# EasyEDA Pro project My_first_PCB.epro, board PCB1
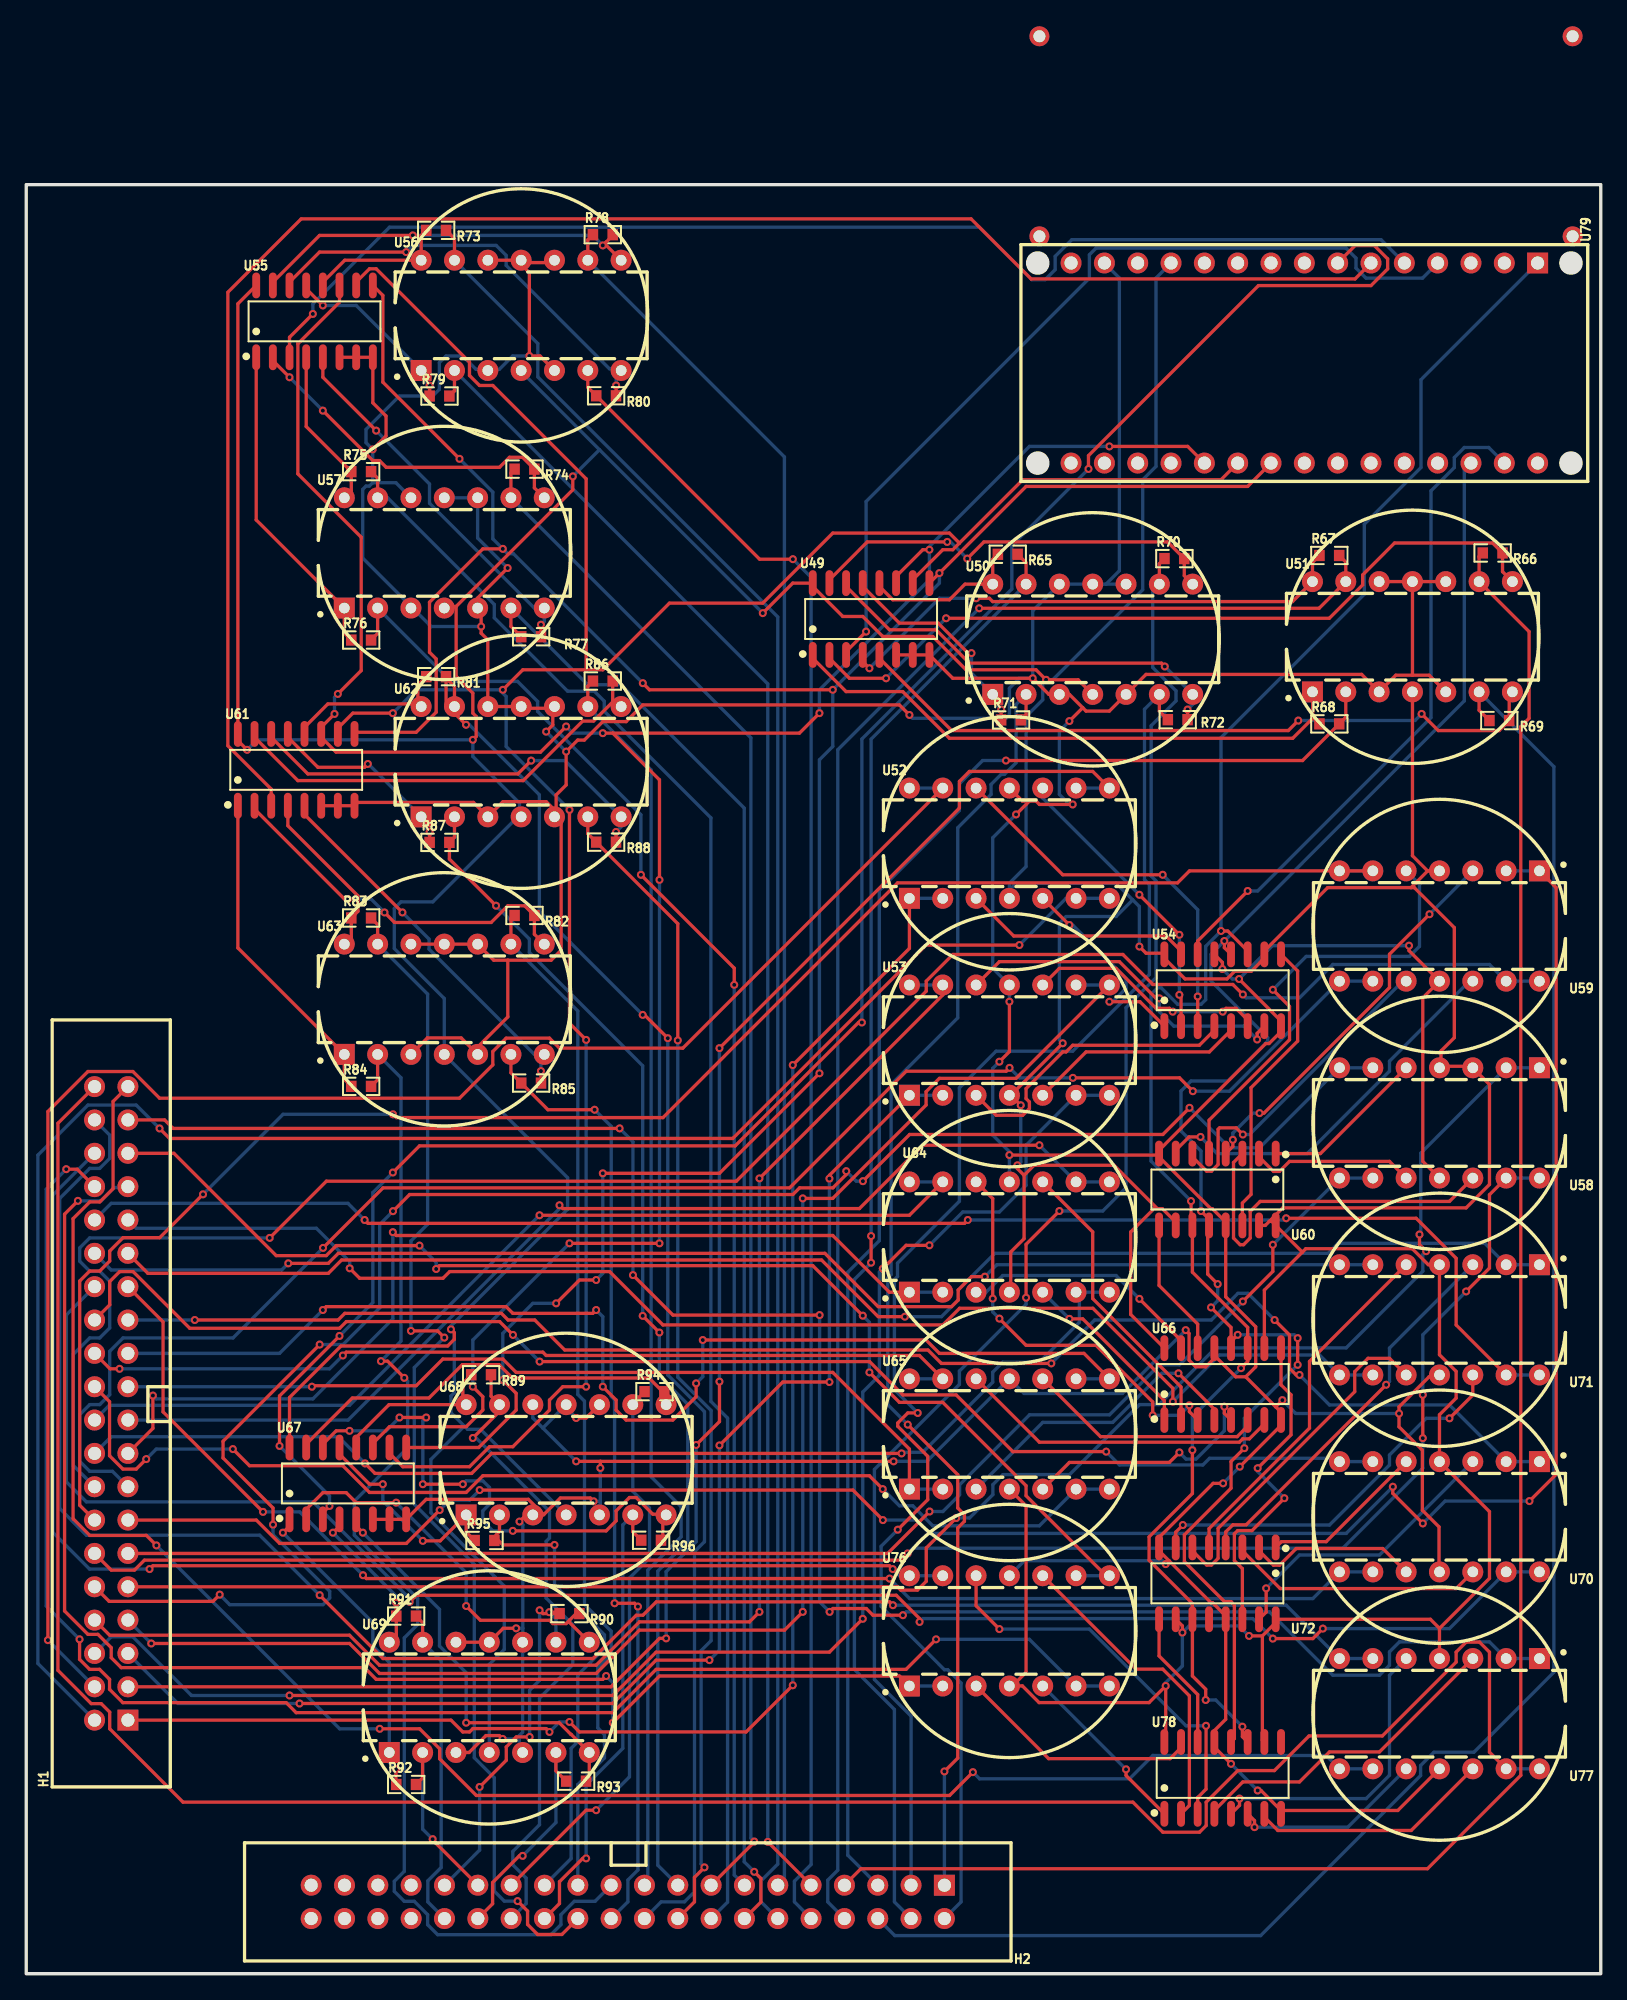
[diagram p4: board, top side]
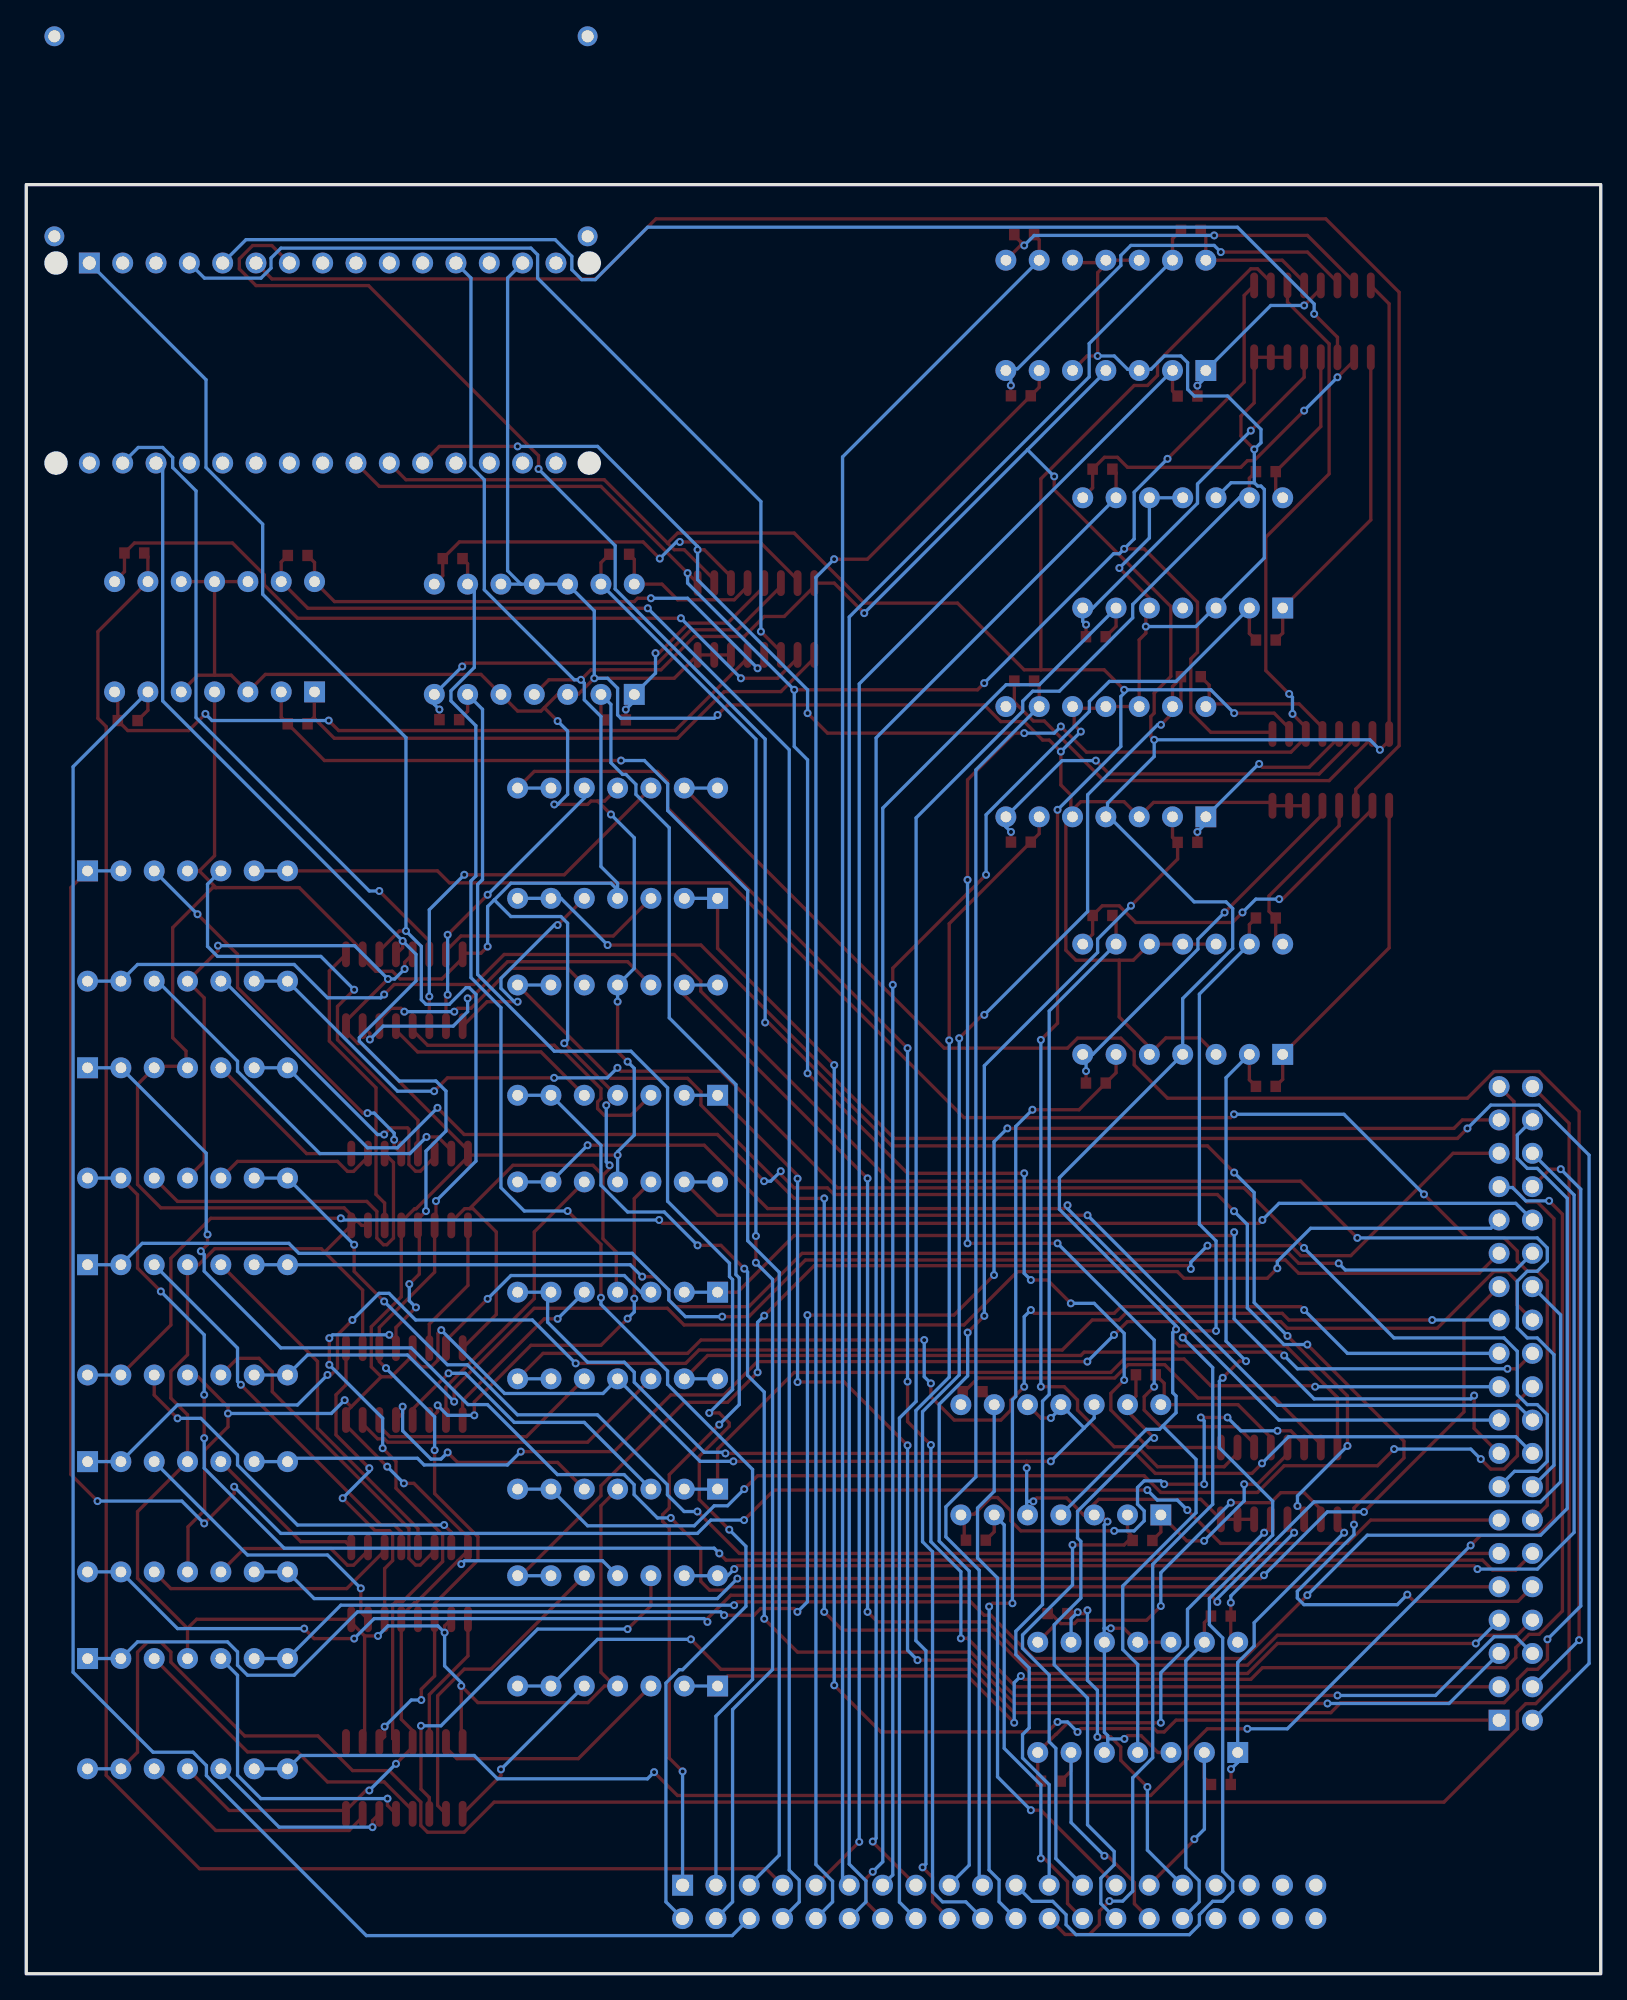
[diagram p5: board, bottom side, seen from below]

Outline 120 x 136.28 mm; copper layers: Top Layer, Bottom Layer. Coordinates in mm from the lower left corner of the outline.
Outline path: rectangle 0,136.28 120,0
Stack: Top Layer 0.035mm / Dielectric1 1.51mm FR4 er 4.5 / Bottom Layer 0.035mm

## Design rules (mm)
template: Custom Config
spacing copperThickness1oz (default): track to track 0.102, other pairs 0.152 to 0.3
spacing copperThickness2oz: track to track 0.203, other pairs 0.152 to 0.3
track width copperThickness1oz (default): min 0.127, default 0.254, max 2.54
track width copperThickness2oz: min 0.203, default 0.254, max 2.54
differential pair differentialPair (default): width min 0.127, default 0.254, max 2.54; gap min 0.152, default 0.152
via viaSize (default): diameter min 0.5, default 0.61, max 10; hole min 0.3, default 0.305, max 6.3

## Placement (name value [footprint] x y rotation side)
H1  HY2541WV-N-2x20P  [HDR-TH_40P-P2.54-V-F-R2-C20-S2.54_6]  6.48 43.45 90 top
H2  HY2541WV-N-2x20P  [HDR-TH_40P-P2.54-V-F-R2-C20-S2.54_6]  45.85 5.47 180 top
NOREF  -  [Pad_e246170]  77.22 147.59 0 top
NOREF#2  -  [Pad_e246173]  117.86 132.35 0 top
NOREF#3  -  [Pad_e246171]  77.22 132.35 0 top
NOREF#4  -  [Pad_e246172]  117.86 147.59 0 top
R65  1kΩ  [R0603]  74.8 108.13 180 top
R66  1kΩ  [R0603]  111.76 108.23 180 top
R67  1kΩ  [R0603]  99.31 108.04 0 top
R68  1kΩ  [R0603]  99.31 95.21 0 top
R69  1kΩ  [R0603]  112.27 95.46 180 top
R70  1kΩ  [R0603]  87.5 107.8 0 top
R71  1kΩ  [R0603]  75.06 95.51 0 top
R72  1kΩ  [R0603]  87.76 95.53 180 top
R73  1kΩ  [R0603]  31.24 132.8 180 top
R74  1kΩ  [R0603]  37.97 114.61 180 top
R75  1kΩ  [R0603]  25.53 114.42 0 top
R76  1kΩ  [R0603]  25.53 101.59 0 top
R77  1kΩ  [R0603]  38.48 101.85 180 top
R78  1kΩ  [R0603]  43.94 132.47 0 top
R79  1kΩ  [R0603]  31.5 120.18 0 top
R80  1kΩ  [R0603]  44.2 120.2 180 top
R81  1kΩ  [R0603]  31.24 98.8 180 top
R82  1kΩ  [R0603]  37.97 80.61 180 top
R83  1kΩ  [R0603]  25.53 80.42 0 top
R84  1kΩ  [R0603]  25.53 67.59 0 top
R85  1kΩ  [R0603]  38.48 67.85 180 top
R86  1kΩ  [R0603]  43.94 98.47 0 top
R87  1kΩ  [R0603]  31.5 86.18 0 top
R88  1kΩ  [R0603]  44.2 86.2 180 top
R89  1kΩ  [R0603]  34.67 45.63 180 top
R90  1kΩ  [R0603]  41.4 27.44 180 top
R91  1kΩ  [R0603]  28.96 27.24 0 top
R92  1kΩ  [R0603]  28.96 14.42 0 top
R93  1kΩ  [R0603]  41.91 14.67 180 top
R94  1kΩ  [R0603]  47.88 44.34 0 top
R95  1kΩ  [R0603]  34.92 33 0 top
R96  1kΩ  [R0603]  47.62 33.02 180 top
U49  CD4051BP  [SOIC-16_L9.9-W3.9-P1.27-LS6.0-BL]  64.39 103.2 0 top
U50  LM324N_C20616361  [DIP-14_L19.2-W6.6-P2.54-LS10.9-BL]  81.28 101.65 0 top
U51  LM324N_C20616361  [DIP-14_L19.2-W6.6-P2.54-LS10.9-BL]  105.65 101.85 0 top
U52  LM324N_C20616361  [DIP-14_L19.2-W6.6-P2.54-LS10.9-BL]  74.93 86.12 0 top
U53  LM324N_C20616361  [DIP-14_L19.2-W6.6-P2.54-LS10.9-BL]  74.93 71.12 0 top
U54  MC74HC595ADR2  [SOIC-16_L9.9-W3.9-P1.27-LS6.0-BL]  91.19 74.92 0 top
U55  CD4051BP  [SOIC-16_L9.9-W3.9-P1.27-LS6.0-BL]  21.97 125.87 0 top
U56  LM324N_C20616361  [DIP-14_L19.2-W6.6-P2.54-LS10.9-BL]  37.72 126.33 0 top
U57  LM324N_C20616361  [DIP-14_L19.2-W6.6-P2.54-LS10.9-BL]  31.86 108.23 0 top
U58  LM324N_C20616361  [DIP-14_L19.2-W6.6-P2.54-LS10.9-BL]  107.71 64.81 180 top
U59  LM324N_C20616361  [DIP-14_L19.2-W6.6-P2.54-LS10.9-BL]  107.71 79.81 180 top
U60  MC74HC595ADR2  [SOIC-16_L9.9-W3.9-P1.27-LS6.0-BL]  90.78 59.74 180 top
U61  CD4051BP  [SOIC-16_L9.9-W3.9-P1.27-LS6.0-BL]  20.57 91.71 0 top
U62  LM324N_C20616361  [DIP-14_L19.2-W6.6-P2.54-LS10.9-BL]  37.72 92.33 0 top
U63  LM324N_C20616361  [DIP-14_L19.2-W6.6-P2.54-LS10.9-BL]  31.86 74.23 0 top
U64  LM324N_C20616361  [DIP-14_L19.2-W6.6-P2.54-LS10.9-BL]  74.93 56.12 0 top
U65  LM324N_C20616361  [DIP-14_L19.2-W6.6-P2.54-LS10.9-BL]  74.93 41.12 0 top
U66  MC74HC595ADR2  [SOIC-16_L9.9-W3.9-P1.27-LS6.0-BL]  91.19 44.92 0 top
U67  CD4051BP  [SOIC-16_L9.9-W3.9-P1.27-LS6.0-BL]  24.51 37.35 0 top
U68  LM324N_C20616361  [DIP-14_L19.2-W6.6-P2.54-LS10.9-BL]  41.15 39.15 0 top
U69  LM324N_C20616361  [DIP-14_L19.2-W6.6-P2.54-LS10.9-BL]  35.29 21.05 0 top
U70  LM324N_C20616361  [DIP-14_L19.2-W6.6-P2.54-LS10.9-BL]  107.71 34.81 180 top
U71  LM324N_C20616361  [DIP-14_L19.2-W6.6-P2.54-LS10.9-BL]  107.71 49.81 180 top
U72  MC74HC595ADR2  [SOIC-16_L9.9-W3.9-P1.27-LS6.0-BL]  90.78 29.74 180 top
U76  LM324N_C20616361  [DIP-14_L19.2-W6.6-P2.54-LS10.9-BL]  74.93 26.12 0 top
U77  LM324N_C20616361  [DIP-14_L19.2-W6.6-P2.54-LS10.9-BL]  107.71 19.81 180 top
U78  MC74HC595ADR2  [SOIC-16_L9.9-W3.9-P1.27-LS6.0-BL]  91.19 14.92 0 top
U79  ABX00028  [MOD-TH_ABX00028]  97.41 122.69 270 top

## Footprints (pads in the part's own frame, mm; a bottom-side part is the same pattern mirrored in y, then rotated)
DIP-14_L19.2-W6.6-P2.54-LS10.9-BL
  rect 1.6x1.6 hole 0.813: 1(-7.62,-4.2)
  round 1.6 hole 0.813: 2(-5.08,-4.2) 3(-2.54,-4.2) 4(0,-4.2) 5(2.54,-4.2) 6(5.08,-4.2) 7(7.62,-4.2) 8(7.62,4.2) 9(5.08,4.2) 10(2.54,4.2) 11(0,4.2) 12(-2.54,4.2) 13(-5.08,4.2) 14(-7.62,4.2)
HDR-TH_40P-P2.54-V-F-R2-C20-S2.54_6
  rect 1.6x1.6 hole 1: 1(-24.13,-1.27)
  round 1.6 hole 1: 2(-24.13,1.27) 3(-21.59,-1.27) 4(-21.59,1.27) 5(-19.05,-1.27) 6(-19.05,1.27) 7(-16.51,-1.27) 8(-16.51,1.27) 9(-13.97,-1.27) 10(-13.97,1.27) 11(-11.43,-1.27) 12(-11.43,1.27) 13(-8.89,-1.27) 14(-8.89,1.27) 15(-6.35,-1.27) 16(-6.35,1.27) 17(-3.81,-1.27) 18(-3.81,1.27) 19(-1.27,-1.27) 20(-1.27,1.27) 21(1.27,-1.27) 22(1.27,1.27) 23(3.81,-1.27) 24(3.81,1.27) 25(6.35,-1.27) 26(6.35,1.27) 27(8.89,-1.27) 28(8.89,1.27) 29(11.43,-1.27) 30(11.43,1.27) 31(13.97,-1.27) 32(13.97,1.27) 33(16.51,-1.27) 34(16.51,1.27) 35(19.05,-1.27) 36(19.05,1.27) 37(21.59,-1.27) 38(21.59,1.27) 39(24.13,-1.27) 40(24.13,1.27)
MOD-TH_ABX00028
  rect 1.6x1.6 hole 1: 1(-7.62,17.78)
  round 1.6 hole 1: 2(-7.62,15.24) 3(-7.62,12.7) 4(-7.62,10.16) 5(-7.62,7.62) 6(-7.62,5.08) 7(-7.62,2.54) 8(-7.62,0) 9(-7.62,-2.54) 10(-7.62,-5.08) 11(-7.62,-7.62) 12(-7.62,-10.16) 13(-7.62,-12.7) 14(-7.62,-15.24) 15(-7.62,-17.78) 16(7.62,-17.78) 17(7.62,-15.24) 18(7.62,-12.7) 19(7.62,-10.16) 20(7.62,-7.62) 21(7.62,-5.08) 22(7.62,-2.54) 23(7.62,0) 24(7.62,2.54) 25(7.62,5.08) 26(7.62,7.62) 27(7.62,10.16) 28(7.62,12.7) 29(7.62,15.24) 30(7.62,17.78)
Pad_e246170
  round 1.524 hole 0.914: 1(0,0)
Pad_e246171
  round 1.524 hole 0.914: 2(0,0)
Pad_e246172
  round 1.524 hole 0.914: 3(0,0)
Pad_e246173
  round 1.524 hole 0.914: 4(0,0)
R0603
  rect 0.806x0.864 smd: 1(-0.753,0) 2(0.753,0)
SOIC-16_L9.9-W3.9-P1.27-LS6.0-BL
  oval 0.602x1.971 smd: 1(-4.445,-2.736) 2(-3.175,-2.736) 3(-1.905,-2.736) 4(-0.635,-2.736) 5(0.635,-2.736) 6(1.905,-2.736) 7(3.175,-2.736) 8(4.445,-2.736) 9(4.445,2.736) 10(3.175,2.736) 11(1.905,2.736) 12(0.635,2.736) 13(-0.635,2.736) 14(-1.905,2.736) 15(-3.175,2.736) 16(-4.445,2.736)

## Nets
As in the schematic.

Pads without a net: H2 33 34 35 36 37 38 39 40; NOREF 1; NOREF#2 4; NOREF#3 2; NOREF#4 3; U72 12; U78 9; U79 2 3 8 9 10 11 13 15 16 17 18 19 23 24 25 26 27 30

## Via types
v1: diameter 0.61, hole 0.305, Top Layer to Bottom Layer, 338 vias

## Routing (per net, layer and track width the routed paths; a pad name or vN(x,y) marks a point on that pad's centre or on a via; arc(x,y) is an arc through that point)
$1N14304: length 51
  Top Layer w0.254: v1(93.09,82.48) 89.28,78.67 U54.14
  Bottom Layer w0.254: v1(93.09,82.48) 93.85,82.48 107.06,95.69 107.06,112.96 108.84,114.74 108.84,115.5 109.6,116.26 111.46,116.26 U79.29
$1N14310: length 17.5
  Top Layer w0.254: U54.15 88.01,77.91 86.87,79.05 75.26,79.05 72.39,81.92
$1N14316: length 119.5
  Top Layer w0.254: v1(41.4,19.18) 42.16,18.42 54.86,18.42 v1(58.42,21.97) ; v1(39.88,18.42) 39.62,18.67 34.04,18.67 33.78,18.42 33.27,18.42 32.37,19.32 H1.1 ; v1(58.42,69.22) 67.31,78.11 U52.1
  Bottom Layer w0.254: U52.1 U52.2 ; v1(39.88,18.42) 40.64,19.18 v1(41.4,19.18) ; v1(58.42,69.22) v1(58.42,21.97)
$1N14330: length 136.1
  Top Layer w0.254: R67.2 100.57,107.53 100.57,106.05 98.54,104.01 v1(72.63,104.01)
  Bottom Layer w0.254: H2.8 61.09,5.47 61.09,7.13 61.85,7.89 61.85,93.23 v1(72.63,104.01)
$1N14338: length 40.1
  Top Layer w0.254: v1(64.26,99.44) 63.75,99.95 63.75,100.46 ; v1(72.39,104.78) 73.41,104.78 73.66,104.52 96.51,104.52 U51.14 98.03,107.5 R67.1
  Bottom Layer w0.254: v1(64.26,99.44) 69.6,104.78 v1(72.39,104.78)
$1N14350: length 111.4
  Top Layer w0.254: v1(64.39,56.2) v1(64.39,54.16) ; U50.13 76.2,107.49 R65.1
  Bottom Layer w0.254: v1(64.39,54.16) 63.12,52.89 63.12,23.18 66.17,20.13 66.17,5.47 H2.4 ; v1(64.39,56.2) 64.39,94.04 U50.13
$1N14355: length 109.9
  Top Layer w0.254: U53.13 69.85,74.56 v1(55.88,60.59) ; H1.8 6.36,25.79 24.64,25.79 26.92,23.5 43.43,23.5 46.74,26.8 55.12,26.8 v1(55.88,27.57)
  Bottom Layer w0.254: U53.13 U53.14 ; v1(55.88,60.59) v1(55.88,27.57)
$1N14369: length 119.8
  Top Layer w0.254: v1(9.53,25.16) 24.64,25.16 26.92,22.87 43.43,22.87 46.74,26.17 57.79,26.17 v1(59.18,27.57) ; v1(59.18,59.06) 61.47,59.06 68.58,66.17 68.58,67.19 69.6,68.21 75.44,68.21 U53.8
  Bottom Layer w0.254: v1(9.53,25.16) H1.7 ; U53.8 80.01,75.32 ; v1(59.18,59.06) v1(59.18,27.57)
$1N14384: length 101.2
  Top Layer w0.254: v1(61.21,45.07) 57.66,45.07 v1(52.83,40.25) ; v1(52.07,23.89) 48.01,23.89 44.7,20.59 v1(20.83,20.59) ; U53.1 61.21,60.82 v1(61.21,60.57)
  Bottom Layer w0.254: v1(52.83,40.25) 52.83,24.65 v1(52.07,23.89) ; v1(61.21,60.57) v1(61.21,45.07) ; H1.5 11.56,20.59 v1(20.83,20.59) ; U53.1 U53.2
$1N14390: length 115.2
  Top Layer w0.254: v1(20.07,21.2) 44.7,21.2 48.01,24.5 61.21,24.5 v1(63.75,27.04) ; v1(65.28,53.71) 67.06,55.49 v1(68.83,55.49)
  Bottom Layer w0.254: v1(20.07,21.2) 12.59,21.2 8.12,25.67 6.48,25.67 H1.6 ; v1(63.75,27.04) 63.75,44.31 65.02,45.58 65.02,53.46 v1(65.28,53.71) ; U53.7 80.01,66.92 76.2,63.11 76.2,60.06 74.17,58.03 71.37,58.03 v1(68.83,55.49)
$1N14396: length 54.2
  Top Layer w0.254: v1(106.35,95.97) 107.62,94.7 112.26,94.7 R69.1 113.02,97.4 U51.7 ; v1(96.95,95.46) 96.19,94.7 70.53,94.7 65.02,100.21 U49.5
  Bottom Layer w0.254: v1(96.95,95.46) 105.84,95.46 v1(106.35,95.97)
$1N14405: length 44.2
  Top Layer w0.254: 98.04,95.63 98.13,95.63 R68.1 ; 98.04,95.63 96.52,94.11 70.36,94.11 66.8,97.67 62.48,97.67 59.94,100.21 U49.1 ; 98.04,95.63 98.04,97.63 U51.1
$1N14418: length 59.7
  Top Layer w0.254: v1(70.1,103.25) 99.31,103.25 101.85,105.79 101.85,106.56 104.29,108.99 111.75,108.99 R66.1 112.51,106.8 U51.8 ; v1(65.53,98.68) 62.74,98.68 61.21,100.21 U49.2
  Bottom Layer w0.254: v1(65.53,98.68) v1(70.1,103.25)
$1N14427: length 653
  Top Layer w0.254: 105.65,98.92 U51.11 ; 105.65,98.92 106.92,98.92 U51.5 ; 105.65,98.92 104.38,98.92 U51.3 101.78,98.98 85.34,98.98 U50.5 82.55,96.18 80.77,96.18 80.52,96.44 ; U51.11 U51.12 ; U51.11 U51.10 ; U60.8 86.22,62.36 v1(74.93,62.36) ; U60.8 86.34,62.22 90.28,58.27 90.4,58.27 91.42,57.26 U60.13 91.42,51.57 93.7,49.28 93.7,46.23 92.94,45.47 ; U60.8 86.34,62.73 94.46,70.86 94.72,70.86 95.48,71.62 ; v1(88.37,49.03) 88.62,48.77 88.62,46.74 89.13,46.23 89.89,46.23 90.65,46.99 ; 34.16,70.27 U63.5 ; 34.16,70.27 33.15,71.29 30.58,71.29 U63.3 ; 34.16,70.27 34.16,70.35 36.7,72.89 36.7,77.21 ; 36.7,77.21 40,77.21 40.77,77.97 40.77,87.62 U62.5 40.39,88.25 40.39,88.52 ; 36.7,77.21 35.63,77.21 U63.10 U63.11 U63.12 ; 95.63,12.44 94.11,13.96 v1(93.85,13.96) ; 95.63,12.44 104.53,12.44 U77.11 ; 95.63,12.44 U78.8 ; 87.1,31.46 86.34,32.22 U72.8 86.39,32.53 86.39,33.29 90.46,37.36 v1(91.22,37.36) ; 87.1,31.46 90.28,28.27 90.4,28.27 91.42,27.26 U72.13 91.42,19.38 90.55,18.52 U78.13 90.55,17.26 v1(91.82,15.99) ; 87.1,31.46 v1(86.84,31.2) ; 76.45,89.33 v1(75.44,88.31) ; 76.45,89.33 76.96,89.33 77.22,89.07 v1(79.76,89.07) ; 76.45,89.33 75.92,89.33 U52.11 ; 43.75,39.03 v1(41.91,39.03) ; 43.75,39.03 v1(66.1,39.03) ; 43.75,39.03 v1(43.75,38.52) ; U61.6 U61.7 U61.8 25.27,89.23 34.08,89.23 U62.3 36.34,89.28 39.62,89.28 40.39,88.52 ; 92.94,45.47 95.23,43.19 ; 92.94,45.47 92.18,45.47 90.65,46.99 ; 95.23,43.19 v1(95.73,43.69) ; 95.23,43.19 95.63,42.78 U66.8 95.63,41.77 v1(92.49,38.63) ; 39.44,34.97 40.71,36.24 42.99,36.24 v1(43.25,35.98) ; 39.44,34.97 38.63,34.97 U68.3 38.1,34.95 v1(37.59,34.44) ; 39.44,34.97 38.26,36.14 30.48,36.14 28.96,34.62 U67.7 U67.6 ; 90.65,46.99 90.65,47.55 U66.13 ; U71.11 107.57,45.47 106.91,45.47 104.62,43.19 v1(104.62,42.68) 104.62,41.66 106.4,39.88 106.4,35.31 107.67,34.04 107.67,30.65 U70.11 ; v1(105.39,78.31) 105.39,77.93 U59.11 106.44,74.34 106.44,61.88 U58.11 ; U69.12 U69.11 36.35,26.31 v1(37.34,26.31) ; v1(67.31,95.89) 66.55,96.65 46.99,96.65 45.72,95.38 43.94,95.38 42.54,93.97 42.03,93.97 v1(41.15,93.09) 41.15,90.55 40.39,89.79 40.39,88.52 ; U54.8 95.63,71.77 95.48,71.62 ; v1(92.43,75.77) 95.48,72.72 95.48,71.62 ; U68.10 42.67,42.33 v1(41.91,42.33) ; 37.84,130.34 37.84,130.09 38.34,129.58 v1(38.34,123.23) 39.16,123.23 U56.5 ; 37.84,130.34 40.07,130.34 U56.10 ; 37.84,130.34 37.84,130.41 U56.11 U56.12 ; v1(91.16,76.53) 91.16,77.04 U54.13 ; v1(74.17,69.48) 74.93,70.24 v1(74.93,74.05) ; 80.52,96.44 v1(79.5,95.42) ; 80.52,96.44 79.5,97.45 U50.3 77.94,97.45 v1(76.71,98.68) 70.61,98.68 U49.8 U49.7 U49.6 ; v1(36.31,17.89) 36.05,18.14 35.04,18.14 33.75,16.85 U69.3 ; v1(36.69,107.08) 34.4,104.79 U57.5 34.67,103.76 v1(34.67,102.62) 34.67,102.12 35.18,101.61 U62.12 U62.11 37.85,96.4 40.13,96.4 ; v1(26.41,116.12) 27.42,117.13 27.42,118.66 26.42,119.66 U55.8 U55.7 U55.6 ; 40.13,96.4 40.13,95.13 v1(39.62,94.62) ; 40.13,96.4 U62.10
  Bottom Layer w0.254: v1(37.59,34.44) 37.85,34.19 37.85,26.31 ; 37.85,26.31 v1(37.34,26.31) ; 37.85,26.31 37.85,25.27 U69.10 37.83,18.4 37.58,18.14 37.58,17.89 ; U69.5 37.58,17.11 37.58,17.89 ; 37.58,17.89 v1(36.31,17.89) ; 35.04,122.21 36.06,122.21 37.07,123.23 v1(38.34,123.23) ; 35.04,122.21 34.28,122.21 33.26,123.23 31.99,123.23 31.48,122.72 31.48,120.69 30.98,120.18 28.44,120.18 25.9,117.64 25.9,116.63 v1(26.41,116.12) 26.41,113.58 ; 35.04,122.21 U56.3 ; 26.41,113.58 28.17,113.58 U57.12 ; 26.41,113.58 26.15,113.32 25.9,113.32 25.64,113.07 25.64,107.84 29.45,104.03 ; v1(105.39,78.31) 94.97,78.31 v1(92.43,75.77) 91.92,75.77 v1(91.16,76.53) ; 39.37,41.57 U68.11 41.15,43.1 v1(41.91,42.33) ; 39.37,41.57 v1(41.91,39.03) ; 39.37,41.57 38.61,42.33 U68.12 ; v1(74.17,69.48) 73.66,68.97 73.66,63.89 74.93,62.62 U64.11 ; v1(95.73,43.69) 96.75,42.68 v1(104.62,42.68) ; 82.3,105.85 U50.10 ; 82.3,105.85 U50.11 U50.12 76.71,103.82 v1(76.71,98.68) 75.69,98.68 74.93,97.92 74.93,95.89 74.68,95.63 67.56,95.63 v1(67.31,95.89) ; 82.3,105.85 83.31,106.87 83.31,129.17 U79.14 ; v1(86.84,31.2) 86.59,31.46 76.07,31.46 U76.11 ; 29.45,104.03 U57.3 ; 29.45,104.03 30.86,102.62 v1(34.67,102.62) ; v1(74.93,74.05) U53.11 73.66,76.59 73.66,86.53 v1(75.44,88.31) ; U57.11 U57.10 34.4,109.37 v1(36.69,107.08) ; v1(43.75,38.52) 43.75,35.98 ; 43.75,35.98 v1(43.25,35.98) ; 43.75,35.98 43.75,35.02 U68.5 ; v1(79.76,89.07) 79.5,89.07 78.74,89.83 78.74,94.66 v1(79.5,95.42) ; v1(88.37,49.03) 83.54,44.2 76.05,44.2 U65.11 68.65,39.03 v1(66.1,39.03) ; v1(92.49,38.63) v1(91.22,37.36) ; v1(41.15,93.09) v1(39.62,94.62) ; v1(91.82,15.99) v1(93.85,13.96)
$1N14475: length 140.4
  Top Layer w0.254: U51.6 110.73,96.25 R69.2
  Bottom Layer w0.254: H2.6 66.2,2.9 94.08,2.9 106.27,15.1 106.27,15.86 107.28,16.87 110.33,16.87 116.43,22.97 116.43,91.94 U51.6
$1N14479: length 611.1
  Top Layer w0.254: 107.71,26.31 U77.4 ; 107.71,26.31 107.01,27 U72.16 95.23,26.75 94.21,25.73 ; 107.71,26.31 111.52,30.12 111.52,35.2 U70.4 107.71,42.58 108.98,43.85 108.98,45.88 107.71,47.15 U71.4 106.86,54.01 105.64,55.23 97.51,55.23 97.26,54.97 ; U60.15 94.43,57 94.75,57.33 ; 76.05,60.82 76.81,61.58 82.91,61.58 86.21,58.28 ; 76.05,60.82 76.05,56 75.03,54.98 75.03,52.02 U64.4 ; 76.05,60.82 75.54,61.33 v1(75.54,61.58) ; U57.4 31.98,104.15 32.77,104.15 ; v1(32.37,49.09) 32.62,48.83 32.62,48.33 32.11,47.82 23.99,47.82 20.07,43.9 U67.16 ; U72.10 88.11,26.5 v1(88.11,25.99) ; v1(56.13,103.65) 58.42,105.93 U49.16 59.94,105.68 62.23,103.39 63.75,103.39 65.28,101.87 69.09,101.87 71.63,99.33 76.96,99.33 v1(77.72,98.57) 80.17,98.57 U50.4 ; 86.21,58.28 86.58,58.28 87.48,57.38 87.48,57.13 U60.10 ; 86.21,58.28 85.95,58.28 84.18,56.5 84.18,50.22 U66.16 ; 94.21,25.73 v1(93.19,25.73) ; 94.21,25.73 94.21,17.8 U78.10 ; 97.26,54.97 U60.16 94.9,57.33 94.75,57.33 ; 97.26,54.97 94.36,52.07 U66.10 ; 105.54,82.73 105.79,82.73 108.84,79.69 108.84,71.3 107.82,70.29 107.82,69.12 ; 105.54,82.73 99.19,82.73 94.36,77.91 U54.10 94.23,77.53 94.23,77.23 93.37,76.37 92.1,76.37 91.52,75.78 88.32,75.78 86.61,77.48 86.61,77.74 ; 105.54,82.73 106.81,84 ; 75.16,21.92 75.92,21.92 77.19,20.65 85.57,20.65 v1(86.84,21.92) 86.84,17.76 U78.16 ; 75.16,21.92 U76.4 ; 75.16,21.92 76.2,22.96 76.2,35.65 U65.4 ; 75.03,66.92 v1(75.79,66.16) ; 75.03,66.92 U53.4 ; 75.03,66.92 v1(78.99,70.88) ; 107.82,69.12 U58.4 ; 107.82,69.12 110.13,69.12 U58.3 111.52,67.74 111.52,60.12 109.74,58.34 95.77,58.34 94.75,57.33 ; U51.4 105.65,85.16 106.81,84 ; 86.61,77.74 U54.16 ; 86.61,77.74 85.34,77.74 v1(84.84,78.25) ; v1(34.04,93.99) 34.29,94.25 34.29,95.77 34.04,96.03 34.04,97.55 32.77,98.82 32.77,104.15 ; 32.77,104.15 41.66,113.04 v1(41.66,114.06) ; 17.53,128.61 16.13,127.21 U61.16 16.13,93.93 v1(16.83,93.23) ; 106.81,84 107.7,84
  Bottom Layer w0.254: 43.69,116.09 37.72,122.06 U56.4 ; 43.69,116.09 v1(41.66,114.06) ; 43.69,116.09 v1(56.13,103.65) ; 37.59,88.25 37.59,89.17 34.04,92.72 v1(34.04,93.99) 17.59,93.99 v1(16.83,93.23) ; 37.59,88.25 U62.4 ; 37.59,88.25 30.99,81.65 28.56,81.65 28.05,81.14 28.05,78.09 31.86,74.28 U63.4 41.26,60.63 41.26,58.23 32.37,49.34 v1(32.37,49.09) 32.62,48.83 32.62,44.26 32.37,44.01 32.37,42.74 33.39,41.72 ; v1(84.84,78.25) 84.84,81.29 84.33,81.8 ; 74.93,82.56 U52.4 ; 74.93,82.56 75.44,83.07 83.06,83.07 84.33,81.8 ; 74.93,82.56 74.93,83.07 76.2,84.34 76.2,95.77 77.47,97.04 77.47,98.31 v1(77.72,98.57) 78.23,98.57 85.09,105.42 85.09,113.81 86.11,114.82 86.11,129.17 U79.12 ; v1(75.79,66.16) 75.79,61.84 v1(75.54,61.58) ; 33.39,41.72 33.64,41.47 34.63,41.47 U68.4 ; 33.39,41.72 30.84,39.18 30.84,35.12 36.43,29.53 36.43,24.7 35.29,23.56 U69.4 ; 84.33,81.8 83.06,80.53 79.25,80.53 78.74,80.02 78.74,71.13 v1(78.99,70.88) ; v1(86.84,21.92) 86.84,22.18 88.11,23.45 v1(88.11,25.99) 88.62,26.5 92.43,26.5 v1(93.19,25.73)
$1N14502: length 32.3
  Top Layer w0.254: v1(71.72,107.8) 72.99,109.07 86.99,109.07 R70.2 88.26,106.5 U50.8 ; v1(70.19,109.07) 64.1,109.07 61.21,106.19 U49.15
  Bottom Layer w0.254: v1(70.19,109.07) 70.45,109.07 v1(71.72,107.8)
$1N14513: length 12.2
  Top Layer w0.254: R65.2 73.66,107.74 U50.14 71.55,105.85 70.36,104.66 66.04,104.66 65.02,105.68 U49.12
$1N14524: length 16.7
  Top Layer w0.254: v1(74.3,96.3) R71.1 ; 63.75,105.93 63.75,105.68 66.55,102.88 69.5,102.88 71.79,100.6 v1(72.04,100.6)
  Bottom Layer w0.254: v1(74.3,96.3) 73.66,96.95 U50.1 72.04,99.07 v1(72.04,100.6)
$1N14533: length 32.2
  Top Layer w0.254: v1(86.77,99.58) 86.52,99.84 71.88,99.84 69.34,102.38 65.79,102.38 62.48,105.68 U49.14 ; v1(88.51,96.3) R72.1
  Bottom Layer w0.254: v1(88.51,96.3) 88.9,96.69 U50.7 v1(86.77,99.58)
$1N14552: length 197.6
  Top Layer w0.254: 71.12,108.98 70.36,109.74 61.47,109.74 56.13,104.41 49.02,104.41 43.94,99.33 42.67,99.33 ; 71.12,108.98 75.95,113.81 91.06,113.81 U79.21 ; 71.12,108.98 70.61,108.47 69.85,108.47 67.56,106.19 U49.10 ; 42.67,99.33 42.67,113.87 35.56,120.99 34.54,120.99 33.78,121.75 33.78,122.76 26.67,129.88 26.16,129.88 25.15,128.86 U55.10 ; 42.67,99.33 37.85,99.33 v1(36.32,97.8) ; U61.10 23.88,94.57 23.88,95.01 24.89,96.03 v1(27.94,96.03) ; U67.10 27.69,39.64 28.7,38.62 33.78,38.62 35.31,40.15 37.08,40.15 39.88,42.94 39.88,43.7 40.89,44.72 v1(42.67,44.72) ; v1(41.4,88.66) 41.4,72.4 v1(42.67,71.13)
  Bottom Layer w0.254: v1(41.4,88.66) 36.58,93.49 36.58,97.3 36.07,97.8 ; v1(36.32,97.8) 36.07,97.8 ; 36.07,97.8 29.72,97.8 v1(27.94,96.03) ; v1(42.67,71.13) v1(42.67,44.72)
$1N14556: length 196.8
  Top Layer w0.254: v1(48.26,83.33) 48.26,90.95 44.7,94.5 ; 44.7,94.5 58.93,94.5 v1(60.45,96.03) ; 44.7,94.5 v1(43.94,94.5) ; v1(82.55,116.35) 88.52,116.35 U79.20 ; v1(48.26,55.64) v1(41.4,55.64) ; U67.11 26.42,40.4 27.69,41.67 33.53,41.67 34.8,42.94 34.8,43.96 v1(34.04,44.72) ; v1(41.15,95.01) 39.19,93.05 23.61,93.05 22.48,94.19 U61.11 22.48,94.95 v1(23.5,95.97) ; v1(23.75,97.49) 25.53,99.27 25.53,109.43 20.7,114.25 20.7,124.16 23.88,127.34 U55.11 ; v1(68.83,108.47) 68.33,108.47 66.29,106.44 U49.11
  Bottom Layer w0.254: v1(48.26,83.33) v1(48.26,55.64) ; v1(60.45,96.03) 60.45,97.8 68.83,106.19 v1(68.83,108.47) 68.83,108.73 76.45,116.35 v1(82.55,116.35) ; v1(41.4,55.64) 34.04,48.27 v1(34.04,44.72) ; v1(23.5,95.97) 23.5,97.24 v1(23.75,97.49) ; v1(41.15,95.01) 41.66,94.5 v1(43.94,94.5)
$1N14560: length 66.8
  Top Layer w0.254: v1(64.01,102.24) 62.48,100.71 U49.3
  Bottom Layer w0.254: v1(64.01,102.24) 64.01,112.14 81.03,129.16 81.03,130.94 81.53,131.45 100.58,131.45 101.35,130.69 101.35,129.92 102.11,129.16 106.42,129.16 U79.4
$1N14564: length 18.5
  Top Layer w0.254: U53.10 78.74,76.59 83.06,76.59 86.11,73.54 87.12,73.54 v1(87.38,73.29) ; U54.6 93.09,72.65 92.2,73.54 91.44,73.54 v1(91.19,73.29)
  Bottom Layer w0.254: v1(87.38,73.29) v1(91.19,73.29)
$1N14568: length 26.5
  Top Layer w0.254: U54.7 93.81,71.63 v1(93.81,71.17) ; 72.39,75.32 74.17,77.1 83.31,77.1 86.11,74.3 v1(86.36,74.3)
  Bottom Layer w0.254: v1(86.36,74.3) 86.36,73.29 87.46,72.18 92.8,72.18 v1(93.81,71.17)
$1N14572: length 23
  Top Layer w0.254: 72.39,66.92 73.91,65.39 75.95,65.39 76.45,65.9 76.45,66.41 76.2,66.66 76.2,67.43 78.99,70.22 79.25,70.22 79.76,70.73 89.41,70.73 90.55,71.87 U54.4
$1N14578: length 16.7
  Top Layer w0.254: U54.5 91.82,71.87 90.17,70.22 80.77,70.22 U53.5
$1N14584: length 22.5
  Top Layer w0.254: v1(84.84,82.19) v1(87.88,79.14) ; U54.2 88.01,74.44 v1(87.88,74.57)
  Bottom Layer w0.254: U52.10 77.47,89.56 v1(84.84,82.19) ; v1(87.88,79.14) v1(87.88,74.57)
$1N14588: length 29.6
  Top Layer w0.254: 72.39,90.32 78.99,83.71 v1(86.61,83.71) ; v1(89.28,74.44) U54.3
  Bottom Layer w0.254: v1(89.28,74.44) 89.28,81.05 v1(86.61,83.71)
$1N14592: length 16.3
  Top Layer w0.254: U54.1 84.88,74.04 v1(82.55,74.04) ; U52.5 v1(79.5,79.89)
  Bottom Layer w0.254: v1(79.5,79.89) 79.76,79.89 83.82,75.82 83.82,75.06 82.8,74.04 v1(82.55,74.04)
$1N16074: length 132.3
  Top Layer w0.254: U61.3 18.67,90.24 15.37,93.54 15.37,128.09 20.95,133.68 72.01,133.68 76.58,129.1 101.28,129.1 U79.6
$1N16078: length 28.5
  Top Layer w0.254: v1(27.31,80.84) 28.07,80.08 35.43,80.08 36.7,81.35 37.99,81.35 R82.1 38.73,79.19 U63.8 ; U61.2 17.4,88.72 24.26,81.86 v1(24.51,81.86)
  Bottom Layer w0.254: v1(27.31,80.84) 26.29,81.86 v1(24.51,81.86)
$1N16087: length 13.2
  Top Layer w0.254: U63.14 24.77,78.96 R83.1 25.28,80.93 25.28,82.1 19.94,87.45 U61.4
$1N16099: length 78.6
  Top Layer w0.254: R82.2 36.94,80.33 U63.9
  Bottom Layer w0.254: U63.9 42.04,73.34 42.04,44.13 42.54,43.62 42.54,28.12 44.58,26.09 44.58,24.31 43.56,23.3 43.56,18.73 44.07,18.22 44.07,16.44 42.04,14.41 H2.23
$1N16103: length 91
  Top Layer w0.254: v1(37.45,5.53) 38.21,4.77 38.21,3.76 38.97,2.99 40.83,2.99 H2.24 ; R83.2 26.78,79.92 U63.13 ; v1(29.32,48.97) 31.35,48.97 v1(31.86,48.46)
  Bottom Layer w0.254: v1(29.32,48.97) 29.32,55.83 30.59,57.1 30.59,74.62 U63.13 ; v1(31.86,48.46) 29.58,46.17 29.58,35.76 34.15,31.19 34.15,16.46 35.67,14.93 35.67,6.3 36.43,5.53 v1(37.45,5.53)
$1N16107: length 108.4
  Top Layer w0.254: 32,98.69 32,96.66 v1(33.52,95.14) ; 32,98.69 R81.1 ; 32,98.69 32.64,98.05 U62.13 ; v1(48.9,71.26) 47.12,73.04 v1(46.98,73.04)
  Bottom Layer w0.254: v1(33.52,95.14) 33.77,95.14 39.11,89.8 39.11,80.91 v1(46.98,73.04) ; v1(48.9,71.26) 48.9,45.61 51.69,42.81 51.69,32.91 50.93,32.15 50.93,6.24 50.16,5.48 48.39,5.48 H2.20
$1N16112: length 25
  Top Layer w0.254: U61.1 16.13,78.14 U63.1 24.24,68.13 R84.1
$1N16119: length 73.7
  Top Layer w0.254: v1(43.32,65.81) 39.76,65.81 R85.2 36.94,68.63 U63.6 ; v1(46.62,27.97) 46.36,28.22 v1(44.84,28.22)
  Bottom Layer w0.254: H2.22 45.86,5.48 45.86,7.14 46.62,7.9 v1(46.62,27.97) ; v1(44.84,28.22) 44.84,43.72 44.59,43.97 44.59,64.54 v1(43.32,65.81)
$1N16123: length 93.7
  Top Layer w0.254: v1(27.03,46.66) 27.54,46.66 v1(28.81,45.39) ; U63.2 26.78,68.1 R84.2
  Bottom Layer w0.254: U63.2 28.56,68.25 28.56,48.19 v1(27.03,46.66) ; v1(28.81,45.39) 29.07,45.14 29.07,40.06 25,36 25,33.41 29.83,28.59 29.83,26.6 28.81,25.58 28.81,7.8 28.05,7.04 28.05,6.28 28.81,5.52 29.58,5.52 30.59,4.5 30.59,3.74 31.35,2.98 39.99,2.98 40.75,3.74 40.75,4.5 41.77,5.52 43.35,5.52 H2.21
$1N16127: length 33.8
  Top Layer w0.254: U62.8 44.99,96.88 44.7,96.88 ; 44.7,96.88 R86.2 ; 44.7,96.88 43.24,95.42 42.41,95.42 37.87,90.89 20.7,90.89 17.4,94.19 U61.15
$1N16138: length 32.4
  Top Layer w0.254: v1(44.95,86.98) R88.1 ; U61.14 18.67,94.19 21.46,91.39 37.47,91.39 v1(38.48,92.41)
  Bottom Layer w0.254: v1(44.95,86.98) 45.34,87.37 U62.7 41.06,92.41 v1(38.48,92.41)
$1N16147: length 15.3
  Top Layer w0.254: U61.13 19.94,94.19 22.22,91.9 25.78,91.9 v1(26.03,92.16) ; v1(30.74,86.98) R87.1
  Bottom Layer w0.254: v1(26.03,92.16) 26.07,92.16 U62.1 30.1,87.62 v1(30.74,86.98)
$1N16156: length 29.1
  Top Layer w0.254: R85.1 39.23,67.85 v1(39.23,68.76) ; v1(28.67,80.84) 21.21,88.3 U61.5
  Bottom Layer w0.254: 39.23,70.03 38.72,70.03 30.7,78.05 30.7,78.81 v1(28.67,80.84) ; 39.23,70.03 v1(39.23,68.76) ; 39.23,70.03 U63.7
$1N16165: length 12.5
  Top Layer w0.254: 29.84,96.73 22.99,96.73 21.21,94.95 U61.12 ; 29.84,96.73 U62.14 ; 29.84,96.73 29.84,98.16 R81.2
$1N16176: length 89.1
  Top Layer w0.254: v1(49.66,71.1) 49.66,79.99 R88.2 42.8,86.84 U62.6 ; v1(51.69,8.1) 50.93,7.34 50.93,5.47 H2.18
  Bottom Layer w0.254: v1(49.66,71.1) 49.66,45.44 52.2,42.9 52.2,25.38 51.44,24.61 51.44,8.36 v1(51.69,8.1)
$1N16182: length 96
  Top Layer w0.254: U62.9 42.8,98.08 R86.1
  Bottom Layer w0.254: U62.9 47.62,91.7 47.62,37.85 49.91,35.57 49.91,33.28 47.37,30.74 47.37,7 H2.19
$1N16188: length 87.6
  Top Layer w0.254: H1.22 6.35,43.57 6.35,39.46 7.37,38.44 8.38,38.44 v1(9.14,39.2) ; v1(15.75,39.97) 17.02,38.7 24.13,38.7 26.16,36.66 33.53,36.66 34.8,37.93 64.26,37.93 v1(65.28,36.92)
  Bottom Layer w0.254: U65.7 80.01,36.92 77.22,34.12 69.09,34.12 67.56,35.65 66.55,35.65 v1(65.28,36.92) ; v1(9.14,39.2) 9.91,39.97 v1(15.75,39.97)
$1N16194: length 69
  Top Layer w0.254: H1.24 6.38,46.08 v1(7.11,46.08) ; v1(24.13,47.1) 24.38,47.35 39.37,47.35 39.62,47.1 68.07,47.1 U65.13
  Bottom Layer w0.254: v1(24.13,47.1) 23.11,46.08 v1(7.11,46.08) ; U65.13 U65.14
$1N16202: length 92.2
  Top Layer w0.254: v1(43.94,44.72) 44.96,43.7 44.96,42.94 45.72,42.18 49.28,42.18 51.05,43.95 v1(51.05,44.97) ; U65.8 80.61,47.26 69.6,47.26 68.58,48.27 v1(51.56,48.27) ; v1(22.61,50.56) 22.86,50.81 36.58,50.81 37.08,50.3 43.18,50.3 v1(43.43,50.56)
  Bottom Layer w0.254: v1(43.94,44.72) 43.94,50.05 v1(43.43,50.56) ; H1.23 19.3,47.26 v1(22.61,50.56) ; U65.8 80.01,45.32 ; v1(51.56,48.27) 51.56,45.48 v1(51.05,44.97)
$1N16223: length 19.2
  Top Layer w0.254: U65.5 79.5,38.95 87.12,38.95 v1(87.88,39.71) ; v1(91.31,43.2) 91.31,42.69 U66.5
  Bottom Layer w0.254: v1(91.31,43.2) 91.31,41.36 89.15,39.2 88.39,39.2 v1(87.88,39.71)
$1N16229: length 24.8
  Top Layer w0.254: 72.39,45.32 77.22,40.49 92.46,40.49 92.71,40.75 93.22,40.75 94.36,41.89 U66.7
$1N16233: length 18.2
  Top Layer w0.254: U65.10 81.87,40.91 92.29,40.91 93.09,41.71 U66.6
$1N16237: length 23.8
  Top Layer w0.254: U66.4 90.55,43 v1(87.81,45.74)
  Bottom Layer w0.254: 72.39,36.92 77.47,42 82.8,42 86.54,45.74 v1(87.81,45.74)
$1N16243: length 22.5
  Top Layer w0.254: U66.2 88.01,44.7 81.28,51.43 81.28,56.51 U64.10
$1N16247: length 31
  Top Layer w0.254: 72.39,60.32 73.66,59.05 v1(73.66,51.43) ; v1(74.17,49.9) 76.2,47.87 81.53,47.87 85.85,43.55 v1(85.85,42.54) ; v1(88.65,43.3) 88.65,42.82 U66.3
  Bottom Layer w0.254: v1(74.17,49.9) 73.66,50.41 v1(73.66,51.43) ; v1(88.65,43.3) 87.88,42.54 v1(85.85,42.54)
$1N16265: length 76.5
  Top Layer w0.254: v1(27.94,56.49) 28.19,56.24 61.47,56.24 65.79,51.92 U64.1 ; H1.17 9.65,41.54 v1(9.65,44.04)
  Bottom Layer w0.254: U64.1 U64.2 ; v1(9.65,44.04) 9.91,43.79 21.84,43.79 27.94,49.89 v1(27.94,56.49)
$1N16271: length 86.8
  Top Layer w0.254: v1(66.71,39.64) 35.47,39.64 33.95,38.11 26.58,38.11 v1(25.82,38.88)
  Bottom Layer w0.254: H1.18 6.48,40.91 23.79,40.91 v1(25.82,38.88) ; 80.26,51.92 U64.7 ; 80.26,51.92 80.26,49.63 77.22,46.58 74.42,46.58 73.66,45.82 73.66,45.06 68.33,39.73 66.8,39.73 v1(66.71,39.64) ; 80.26,51.92 80.01,51.92
$1N16277: length 14.2
  Top Layer w0.254: v1(79.5,49.89) 80.52,49.89 86.74,43.66 U66.1
  Bottom Layer w0.254: U64.5 v1(79.5,49.89)
$1N16282: length 18.8
  Top Layer w0.254: U66.15 88.01,48.23 v1(84.84,51.41)
  Bottom Layer w0.254: 72.39,51.92 73.15,51.92 74.42,53.19 83.06,53.19 v1(84.84,51.41)
$1N16332: length 123.6
  Top Layer w0.254: R75.2 26.78,113.92 U57.13
  Bottom Layer w0.254: H2.16 53.45,5.46 53.45,42.33 52.18,43.6 52.18,88.05 44.05,96.18 44.05,96.94 43.29,97.7 41.26,97.7 35.67,103.29 35.67,104.3 27.54,112.43 U57.13
$1N16336: length 12.3
  Top Layer w0.254: U55.4 21.34,117.86 R75.1 24.77,112.96 U57.14
$1N16381: length 108.4
  Top Layer w0.254: v1(95.01,55.53) 95.01,53.5 v1(92.72,51.21) ; H1.11 65.65,32.02 v1(68.85,35.21)
  Bottom Layer w0.254: v1(68.85,35.21) 69.86,35.21 71.13,36.48 71.13,37.24 76.47,42.58 82.56,42.58 86.37,46.39 87.9,46.39 v1(92.72,51.21) ; v1(95.01,55.53) U58.8 U58.9
$1N16387: length 132.2
  Top Layer w0.254: v1(106.44,44.1) v1(106.44,40.8) ; U58.13 111.52,59.34 111.52,53.75 v1(109.74,51.97) ; v1(67.18,32.02) 66.67,31.51 9.01,31.51 8.25,30.75 6.48,30.75 H1.12
  Bottom Layer w0.254: v1(67.18,32.02) 67.58,32.42 100.34,32.42 106.44,38.51 v1(106.44,40.8) ; v1(106.44,44.1) 106.44,48.67 v1(109.74,51.97) ; U58.13 U58.14
$1N16395: length 166.2
  Top Layer w0.254: v1(114.57,36) 116.6,38.04 116.6,82.74 U59.1 ; v1(31.51,35.32) 28.97,32.78 19.32,32.78 17.54,34.56 H1.13 ; v1(65.29,34.56) 63,36.84 v1(34.56,36.84) ; v1(104.15,37.1) 104.15,36.59 v1(106.44,34.3)
  Bottom Layer w0.254: U59.1 U59.2 ; v1(106.44,34.3) 108.14,36 v1(114.57,36) ; v1(65.29,34.56) 67.83,34.56 68.85,33.54 100.6,33.54 v1(104.15,37.1) ; v1(31.51,35.32) 32.27,36.08 33.79,36.08 v1(34.56,36.84)
$1N16401: length 131.9
  Top Layer w0.254: v1(106.18,56.31) 106.18,55.55 v1(106.69,55.04) ; v1(70.88,34.72) 68.59,32.43 68.59,29.89 67.92,29.22 66.65,29.22 66.4,29.48 H1.9
  Bottom Layer w0.254: U58.1 U58.2 106.28,62.51 106.28,56.41 v1(106.18,56.31) ; v1(106.69,55.04) 106.44,54.79 106.44,53.52 100.6,47.67 90.65,47.67 86.33,43.36 84.85,43.36 79.51,38.02 74.43,38.02 73.67,37.26 73.67,36.5 71.89,34.72 v1(70.88,34.72)
$1N16407: length 140.9
  Top Layer w0.254: v1(18.81,34.21) 18.81,35.48 15,39.29 15,40.56 v1(22.36,47.93) ; v1(27.95,58.09) 29.22,59.36 58.43,59.36 58.94,59.87 61.48,59.87 62.5,60.88 v1(62.5,61.14) ; v1(88.66,65.96) 86.63,63.93 67.32,63.93 v1(63.77,60.37) ; H1.10 6.31,28.37 14.24,28.37 v1(14.74,28.88)
  Bottom Layer w0.254: v1(18.81,34.21) 18.81,33.45 23.13,29.13 23.13,28.62 22.62,28.12 15.51,28.12 v1(14.74,28.88) ; v1(62.5,61.14) 63.26,60.37 v1(63.77,60.37) ; v1(88.66,65.96) 91.71,62.91 93.99,62.91 U58.7 U58.6 ; v1(27.95,58.09) 26.94,57.07 26.94,50.72 24.14,47.93 v1(22.36,47.93)
$1N16413: length 133.4
  Top Layer w0.254: U59.6 U59.7 88.66,84.01 87.74,83.1 66.41,83.1 48.53,65.21 28.21,65.21 v1(27.95,65.47) ; v1(13.47,59.37) 10.17,56.07 7.38,56.07 6.36,55.05 6.36,54.29 5.6,53.53 4.84,53.53 4.08,52.77 4.08,35.69 H1.14
  Bottom Layer w0.254: v1(27.95,65.47) 19.57,65.47 v1(13.47,59.37) ; U59.6 U59.7
$1N16419: length 123.7
  Top Layer w0.254: v1(74.94,69.01) 74.69,68.75 67.07,68.75 58.18,59.86 27.19,59.86 v1(22.62,55.29) ; v1(79.77,68.24) 87.9,68.24 v1(88.91,67.23)
  Bottom Layer w0.254: v1(22.62,55.29) 15.76,48.43 7.38,48.43 6.36,47.42 6.36,44.11 5.6,43.35 4.84,43.35 4.08,42.59 4.08,39.03 4.84,38.27 6.57,38.27 H1.15 ; v1(88.91,67.23) 91.71,67.23 U59.8 U59.9 ; v1(79.77,68.24) 75.7,68.24 v1(74.94,69.01)
$1N16427: length 145.8
  Top Layer w0.254: v1(18.55,56.05) 22.87,60.37 54.11,60.37 68.59,74.85 68.59,75.61 70.62,77.64 83.58,77.64 85.86,75.36 91.96,75.36 v1(92.72,74.59)
  Bottom Layer w0.254: H1.16 3.57,38.74 3.57,47.16 4.84,48.43 5.6,48.43 6.36,49.19 6.36,52.75 5.6,53.51 4.84,53.51 4.08,54.27 4.08,55.29 4.84,56.05 v1(18.55,56.05) ; U59.14 U59.13 111.52,76.88 99.58,76.88 97.04,74.34 92.98,74.34 v1(92.72,74.59)
$1N16435: length 34.3
  Top Layer w0.254: v1(95.01,74.96) 96.28,73.69 96.28,71.15 90.15,65.01 U60.5
  Bottom Layer w0.254: U59.5 106.18,82.99 106.18,78.26 105.42,77.5 97.55,77.5 v1(95.01,74.96)
$1N16441: length 25
  Top Layer w0.254: v1(92.72,63.93) 92.21,64.43 90.94,64.43 90.84,64.33 90.84,61.64 90.33,61.13 89.97,61.13 88.88,62.22 U60.6
  Bottom Layer w0.254: U59.10 104.91,75.61 93.23,63.93 v1(92.72,63.93)
$1N16445: length 29.8
  Top Layer w0.254: v1(93.99,65.56) 94.34,65.56 103.9,75.12 103.9,77.66 v1(106.95,80.71) ; U60.4 91.96,63.02 v1(91.96,63.53)
  Bottom Layer w0.254: v1(93.99,65.56) 93.48,65.56 91.96,64.03 v1(91.96,63.53) ; U59.3 v1(106.95,80.71)
$1N16451: length 29.7
  Top Layer w0.254: U60.7 87.61,62.73 88.62,63.74 v1(89.49,63.74)
  Bottom Layer w0.254: U59.12 109.99,75.61 103.9,69.51 103.9,68.75 97.62,62.47 90.76,62.47 v1(89.49,63.74)
$1N16455: length 12.6
  Top Layer w0.254: U58.5 98.63,62.47 U60.1
$1N16460: length 28.5
  Top Layer w0.254: U58.12 108.47,58.83 94.04,58.83 93.28,58.07 93.28,56.04 92.77,55.53 92.52,55.53 92.01,56.04 92.01,61.8 U60.3
$1N16464: length 12.8
  Top Layer w0.254: U58.10 103.9,61.88 96.28,61.88 95.52,61.12 95.06,61.12 93.96,62.22 U60.2
$1N16468: length 127.5
  Top Layer w0.254: U56.6 42.8,120.84 R80.2 55.89,107.75 v1(58.43,107.75)
  Bottom Layer w0.254: v1(58.43,107.75) 59.82,106.37 59.82,8.32 58.55,7.05 58.55,5.47 H2.10
$1N16487: length 24.5
  Top Layer w0.254: R76.1 24.24,102.13 U57.1 17.53,110.75 17.53,123.13
$1N16494: length 28.8
  Top Layer w0.254: 22.61,123.13 22.61,121.61 v1(26.67,117.55) ; R77.1 39.23,101.85 v1(39.23,102.76)
  Bottom Layer w0.254: v1(26.67,117.55) 30.73,113.48 30.73,112.02 38.72,104.03 U57.7 39.48,103.02 v1(39.23,102.76)
$1N16503: length 30.2
  Top Layer w0.254: 44.2,131.91 44.2,131.67 U56.8 ; 44.2,131.91 v1(43.94,131.65) ; 44.2,131.91 44.7,132.41 R78.2 ; U55.15 18.8,128.86 22.35,132.42 v1(29.46,132.42)
  Bottom Layer w0.254: v1(43.94,131.65) 43.18,132.42 v1(29.46,132.42)
$1N16514: length 140.1
  Top Layer w0.254: U56.13 32.64,132.16 R73.1
  Bottom Layer w0.254: U56.13 38.99,124.18 38.99,121.64 57.28,103.35 57.28,8.35 56.01,7.08 56.01,5.47 H2.12
$1N16519: length 10.9
  Top Layer w0.254: 22.61,128.61 22.61,128.86 24.27,130.53 U56.14 30.1,132.41 R73.2
$1N16534: length 112.2
  Top Layer w0.254: U57.6 36.94,102.63 R77.2 ; H2.14 55.99,5.46 55.99,7.26 v1(55.48,7.77)
  Bottom Layer w0.254: U57.6 42.78,98.19 45.32,98.19 54.72,88.79 54.72,8.53 v1(55.48,7.77)
$1N16538: length 33.1
  Top Layer w0.254: U55.14 20.07,128.86 22.35,131.15 v1(28.96,131.15) ; R80.1 44.96,120.21 v1(44.96,120.99)
  Bottom Layer w0.254: 44.96,122.26 v1(44.96,120.99) ; 44.96,122.26 45.21,122.26 U56.7 ; 44.96,122.26 44.45,122.26 36.58,130.13 36.58,130.89 35.81,131.65 29.46,131.65 v1(28.96,131.15)
$1N16547: length 13.8
  Top Layer w0.254: v1(22.61,127.08) 21.34,128.35 U55.13 ; v1(30.74,120.98) R79.1
  Bottom Layer w0.254: v1(30.74,120.98) 30.1,121.62 U56.1 25.14,127.08 v1(22.61,127.08)
$1N16568: length 94.7
  Top Layer w0.254: U55.3 20.07,124.66 v1(21.84,126.44)
  Bottom Layer w0.254: U79.5 103.25,132.09 79.69,132.09 78.42,130.82 78.42,129.81 77.66,129.04 76.64,129.04 72.64,133.04 27.69,133.04 21.84,127.2 v1(21.84,126.44)
$1N16572: length 26.7
  Top Layer w0.254: v1(22.61,119.07) 26.42,115.26 26.92,115.26 27.43,114.75 36.07,114.75 36.83,115.51 37.82,115.51 R74.1 38.73,113.19 U57.8 ; v1(20.07,121.61) 18.8,122.88 U55.2
  Bottom Layer w0.254: v1(20.07,121.61) v1(22.61,119.07)
$1N21935: length 22.3
  Top Layer w0.254: U72.15 94.5,27.55 v1(94.5,29.36)
  Bottom Layer w0.254: U70.3 103.14,31.9 97.04,31.9 v1(94.5,29.36)
$1N21941: length 136
  Top Layer w0.254: v1(68.08,26.8) 68.08,27.05 66.31,28.83 29.73,28.83 v1(29.22,28.32) ; v1(95.01,25.53) 98.06,25.53 v1(98.82,26.29)
  Bottom Layer w0.254: v1(95.01,25.53) 93.48,27.05 68.34,27.05 v1(68.08,26.8) ; H1.28 3.06,50.19 3.06,37.47 4.58,35.94 21.86,35.94 29.22,28.58 v1(29.22,28.32) ; U70.14 U70.13 108.47,26.29 v1(98.82,26.29)
$1N22016: length 19.5
  Top Layer w0.254: U70.12 108.98,29.34 95.57,29.34 92.69,32.22 U72.3
$1N22174: length 18.7
  Top Layer w0.254: 72.39,21.92 77.92,16.38 87.18,16.38 88.01,17.22 U78.15
$1N22192: length 145.4
  Top Layer w0.254: H1.39 6.62,66.45 6.62,59.81 5.6,58.79 4.84,58.79 3.57,57.52 3.57,34.66 4.84,33.39 9.16,33.39 v1(9.92,32.63) ; v1(26.94,18.66) 29.98,18.66 31.51,17.13 31.51,16.37 34.3,13.58 70.37,13.58 v1(72.15,15.36)
  Bottom Layer w0.254: v1(72.15,15.36) 72.66,14.85 84.09,14.85 85.86,16.63 99.07,16.63 U77.8 U77.9 ; v1(26.94,18.66) 23.89,18.66 v1(9.92,32.63)
$1N22200: length 180.3
  Top Layer w0.254: U77.13 111.52,16.88 111.52,24.5 110.76,25.26 109.74,25.26 108.98,24.5 108.98,23.74 103.35,18.11 97.77,18.11 95.13,15.47 92.33,15.47 89.93,13.07 89.93,11.29 89.42,10.78 86.63,10.78 84.34,13.07 11.95,13.07 6.36,18.66 6.36,19.93 5.72,20.57 4.95,20.57 2.41,23.11 2.41,64.78 H1.40
  Bottom Layer w0.254: U77.13 U77.14
$1N22248: length 24.7
  Top Layer w0.254: U77.3 103.14,16.9 99.33,16.9 97.04,14.61 92.72,14.61 90.55,12.44 U78.4
$1N22254: length 23
  Top Layer w0.254: U78.5 92.47,12.83 v1(92.47,13.34)
  Bottom Layer w0.254: U77.5 103.9,22.74 103.9,15.12 102.12,13.34 v1(92.47,13.34)
$1N22260: length 140.5
  Top Layer w0.254: v1(66.05,28.07) 65.8,28.33 48.02,28.33 47,27.31 46.49,27.31 43.19,24.01 27.19,24.01 v1(22.36,28.84)
  Bottom Layer w0.254: H1.38 6.36,63.88 6.36,62.11 5.6,61.35 4.84,61.35 2.55,59.06 2.55,35.44 4.58,33.41 17.79,33.41 v1(22.36,28.84) ; U77.6 U77.7 96.02,28.07 v1(66.05,28.07)
$1N22272: length 99.6
  Top Layer w0.254: v1(66.04,30.83) 65.79,31.08 9.65,31.08 v1(9.4,30.83)
  Bottom Layer w0.254: v1(66.04,30.83) 66.55,30.32 U76.14 U76.13 ; v1(9.4,30.83) 4.83,30.83 2.03,33.62 2.03,59.32 H1.36
$1N22280: length 94.5
  Top Layer w0.254: v1(63.75,50.13) 59.94,53.94 31.5,53.94 v1(31.24,53.69) ; H1.35 11.25,62.5 19.05,54.7 22.86,54.7 23.62,55.46 v1(29.97,55.46) ; v1(64.26,45.81) 66.55,43.53 69.85,43.53 76.2,37.18 76.2,36.41 82.3,30.32 U76.8
  Bottom Layer w0.254: v1(31.24,53.69) 31.24,54.19 v1(29.97,55.46) ; v1(63.75,50.13) 64.26,49.62 v1(64.26,45.81) ; U76.8 80.01,30.32
$1N22286: length 126.1
  Top Layer w0.254: H1.34 3.88,61.29 v1(3.05,61.29) ; v1(69.34,25.47) 67.06,23.19 48.01,23.19 44.7,19.89 20.57,19.89 19.81,20.65 7.37,20.65 6.35,21.66 6.35,22.43 5.59,23.19 4.83,23.19 4.06,23.95 v1(4.06,25.47)
  Bottom Layer w0.254: v1(4.06,25.47) 1.52,28.01 1.52,59.76 v1(3.05,61.29) ; U76.7 80.01,21.92 76.45,25.47 v1(69.34,25.47)
$1N22292: length 110.6
  Top Layer w0.254: U76.1 66.55,22.68 48.26,22.68 v1(44.7,19.12) ; v1(3.94,58.87) 2.92,57.86 2.92,27.63 4.7,25.85 5.46,25.85 6.48,24.84 6.48,24.08 7.24,23.31 25.78,23.31 26.67,22.43 43.94,22.43 v1(44.2,22.68)
  Bottom Layer w0.254: H1.33 7.68,59.89 6.73,59.89 5.72,58.87 v1(3.94,58.87) ; v1(44.2,22.68) 44.7,22.17 v1(44.7,19.12) ; U76.1 U76.2
$1N22298: length 11.8
  Top Layer w0.254: v1(28.19,28.27) 28.19,27.25 R91.1 28.2,25.79 U69.14 ; v1(23.37,33.6) 23.88,34.11 23.88,34.62
  Bottom Layer w0.254: v1(28.19,28.27) 28.19,28.77 v1(23.37,33.6)
$1N22310: length 29.5
  Top Layer w0.254: v1(39.12,27.69) 39.38,27.44 R90.2 40.54,27.54 v1(39.86,27.54) ; v1(38.36,18.04) 37.35,18.04 36.58,17.28 36.58,16.26 v1(34.55,14.23)
  Bottom Layer w0.254: v1(38.36,18.04) 38.36,21.59 39.12,22.36 v1(39.12,27.69) ; U69.9 40.37,27.03 v1(39.86,27.54) ; H2.31 34.55,9.42 v1(34.55,14.23)
$1N22314: length 24.8
  Top Layer w0.254: 30.21,25.25 30.21,26.74 R91.2
  Bottom Layer w0.254: 30.21,25.25 31.62,23.84 31.62,8.09 30.61,7.08 30.61,5.47 H2.32
$1N22318: length 30.3
  Top Layer w0.254: 41.4,26.93 41.15,26.67 40.13,26.67 39.88,26.93 34.61,26.93 v1(33.53,28.01) ; 41.4,26.93 41.4,26.76 U69.8 ; 41.4,26.93 41.91,27.44 R90.1 ; v1(28.19,35.89) 25.15,35.89 24.38,36.65 22.61,36.65 21.34,35.38 U67.2
  Bottom Layer w0.254: v1(33.53,28.01) 33.53,30.55 v1(28.19,35.89)
$1N22327: length 30.6
  Top Layer w0.254: v1(89.92,18.89) 89.92,14.06 89.28,13.43 U78.3 ; v1(74.17,26.25) 72.39,28.03 72.39,30.32
  Bottom Layer w0.254: v1(74.17,26.25) 81.03,26.25 88.39,18.89 v1(89.92,18.89)
$1N22331: length 18.5
  Top Layer w0.254: U77.12 105.55,10.91 95.39,10.91 94.36,11.94 U78.7
$1N22335: length 14.6
  Top Layer w0.254: v1(93.61,11.17) 93.61,11.66 U78.6
  Bottom Layer w0.254: U77.10 100.72,11.17 v1(93.61,11.17)
$1N22339: length 24.2
  Top Layer w0.254: U78.2 88.65,12.82 88.65,21.17 86.61,23.21 84.58,23.21 U76.10
$1N22343: length 13.6
  Top Layer w0.254: v1(83.82,15.57) 83.82,15.1 U78.1
  Bottom Layer w0.254: U76.5 v1(83.82,15.57)
$1N22348: length 48.8
  Top Layer w0.254: R89.1 35.42,43.99 U68.13 36.07,42.84 v1(34.04,40.81)
  Bottom Layer w0.254: v1(34.04,40.81) 34.29,40.81 39.88,35.22 39.88,33.19 39.62,32.94 39.62,28.62 41.66,26.59 41.66,23.54 39.12,21 39.12,11.35 37.08,9.31 37.08,8.3 38.1,7.28 38.1,5.35 H2.28
$1N22353: length 17.8
  Top Layer w0.254: U69.6 40.37,15.46 R93.2 ; H2.30 35.54,5.33 35.54,6.95 37.58,8.98 v1(37.83,8.98)
  Bottom Layer w0.254: U69.6 40.37,11.52 v1(37.83,8.98)
$1N22357: length 31.6
  Top Layer w0.254: R93.1 42.91,14.92 U69.7 41.53,18.23 41.51,18.23 40.62,19.12 v1(33.53,19.12) ; U67.5 25.15,34.11 v1(25.65,33.6)
  Bottom Layer w0.254: v1(33.53,19.12) 33.53,22.93 31.5,24.96 31.5,27.76 v1(25.65,33.6)
$1N22366: length 32
  Top Layer w0.254: 48.48,44.37 48.77,44.07 U68.8 ; 48.48,44.37 R94.2 ; 48.48,44.37 47.46,45.38 37.05,45.38 36.03,46.4 33.24,46.4 30.7,43.86 24.85,43.86 21.34,40.34 U67.15
$1N22377: length 40.7
  Top Layer w0.254: 48.51,35.01 48.51,33.16 R96.1 ; 48.51,35.01 48.71,35.01 U68.7 ; 48.51,35.01 47.75,35.01 46.48,36.28 45.97,36.28 44.96,35.26 44.96,34.5 44.2,33.74 v1(37.08,33.74) ; v1(28.45,42.37) v1(30.48,42.37) ; v1(30.23,37.29) v1(33.27,37.29) ; v1(24.64,41.36) 23.62,41.36 22.61,40.34 U67.14
  Bottom Layer w0.254: v1(30.48,42.37) 30.23,42.12 v1(30.23,37.29) ; v1(37.08,33.74) 35.56,33.74 34.8,34.5 34.8,35.26 35.31,35.77 35.31,37.04 34.8,37.55 33.53,37.55 v1(33.27,37.29) ; v1(24.64,41.36) 27.43,41.36 v1(28.45,42.37)
$1N22386: length 24
  Top Layer w0.254: v1(28.18,15.58) 28.18,14.44 R92.1 ; v1(19.56,33.6) 20.07,34.11 U67.1
  Bottom Layer w0.254: v1(19.56,33.6) 26.42,26.74 26.42,24.96 27.67,23.71 U69.1 27.67,16.09 v1(28.18,15.58)
$1N22397: length 12.8
  Top Layer w0.254: R89.2 33.27,44.98 33.27,43.6 33.53,43.35 27.65,43.35 25.15,40.85 U67.12
$1N22408: length 16.7
  Top Layer w0.254: R95.1 33.53,33.65 33.53,34.95 31.55,32.97 v1(30.23,32.97) ; 23.88,40.09 23.88,39.58 26.16,37.29 v1(27.18,37.29)
  Bottom Layer w0.254: v1(27.18,37.29) 27.18,36.02 v1(30.23,32.97)
$1N22417: length 200.9
  Top Layer w0.254: v1(36.32,108.54) 34.8,108.54 30.73,104.48 30.73,100.67 31.24,100.16 31.24,96.09 29.72,94.57 25.15,94.57 U61.9 ; U79.22 93.09,113.3 76.2,113.3 v1(69.6,106.69) U49.9 ; v1(61.47,97.8) 47.5,97.8 v1(46.99,98.31) ; U55.9 27.18,127.84 27.18,121.24 v1(33.02,115.4) ; 28.96,40.09 34.48,40.09 37.34,42.94 37.34,44.21 v1(36.32,45.23) ; v1(60.45,68.59) 52.83,60.97 v1(43.94,60.97) ; v1(40.39,51.07) 42.16,52.85 v1(43.43,52.85)
  Bottom Layer w0.254: v1(43.43,52.85) 43.94,53.35 v1(43.94,60.97) ; v1(46.99,98.31) 37.13,108.17 36.69,108.17 v1(36.32,108.54) 35.56,109.3 35.56,112.86 v1(33.02,115.4) ; v1(60.45,68.59) 60.45,92.47 61.47,93.49 v1(61.47,97.8) 69.6,105.93 v1(69.6,106.69) ; v1(40.39,51.07) 38.61,51.07 36.32,48.78 v1(36.32,45.23)
$1N22429: length 156.8
  Top Layer w0.254: v1(19.3,40.2) 19.3,44.01 v1(23.88,48.59) ; U67.3 22.61,35.12 v1(23.11,35.63) ; v1(27.94,61.03) 29.97,63.06 54.03,63.06 63.43,72.46 v1(63.69,72.46) ; U79.7 101.28,131.64 102.74,131.64 103.76,130.63 103.76,129.87 102.49,128.6 93.91,128.6 80.96,115.64 v1(80.96,114.63)
  Bottom Layer w0.254: v1(23.11,35.63) 23.11,36.39 v1(19.3,40.2) ; v1(80.96,114.63) 75.12,108.78 75.12,105.48 63.69,94.05 v1(63.69,72.46) ; v1(23.88,48.59) 26.42,51.13 26.42,59.51 v1(27.94,61.03)
$1N22441: length 119.4
  Top Layer w0.254: v1(25.79,57.42) 26.04,57.16 71.51,57.16 v1(71.76,57.42) ; v1(96.02,57.55) 105.93,57.55 108.98,54.5 108.98,49.42 U71.13
  Bottom Layer w0.254: H1.32 6.48,58.69 24.52,58.69 v1(25.79,57.42) ; v1(96.02,57.55) 95.89,57.42 v1(71.76,57.42) ; U71.13 U71.14
$1N22449: length 35.9
  Top Layer w0.254: v1(42.67,8.79) 42.42,8.79 40.64,7.01 40.64,5.35 H2.26 ; U68.6 46.23,33.67 R96.2
  Bottom Layer w0.254: v1(42.67,8.79) 42.67,14.38 45.47,17.17 45.47,34.19 U68.6
$1N22455: length 36.1
  Top Layer w0.254: 35.81,33.17 R95.2 ; 35.81,33.17 36.32,32.66 v1(40.26,32.66) ; 35.81,33.17 35.81,33.43 36.07,33.68 U68.2
  Bottom Layer w0.254: H2.25 41.53,8.78 41.53,17.17 42.04,17.68 42.04,22.76 44.07,24.79 44.07,25.81 40.26,29.62 v1(40.26,32.66)
$1N22462: length 43.3
  Top Layer w0.254: R94.1 46.23,43.44 U68.9 ; v1(43.43,12.46) 42.67,12.46 H2.27
  Bottom Layer w0.254: U68.9 46.23,36.75 47.5,35.48 47.5,31.67 45.97,30.14 45.97,15 v1(43.43,12.46)
$1N22468: length 27.8
  Top Layer w0.254: U71.5 97.8,46.64 97.8,41.56 90.15,33.91 U72.5
$1N22474: length 26.3
  Top Layer w0.254: U71.10 103.9,46.88 102.27,46.88 101.25,45.86 101.25,44.34 90.84,33.93 90.84,31.64 90.33,31.13 89.97,31.13 88.88,32.22 U72.6
$1N22478: length 29.9
  Top Layer w0.254: U72.4 91.42,33.65 91.96,34.2 92.98,34.2 v1(103.64,44.87)
  Bottom Layer w0.254: U71.3 103.9,47.66 103.9,45.12 v1(103.64,44.87)
$1N22484: length 30.1
  Top Layer w0.254: v1(88.15,34.18) 87.61,33.64 U72.7 ; U71.12 110.25,44.09 v1(108.47,42.31)
  Bottom Layer w0.254: v1(108.47,42.31) 106.69,42.31 103.9,39.51 103.9,38.75 99.33,34.18 v1(88.15,34.18)
$1N22488: length 13.2
  Top Layer w0.254: U72.2 93.96,32.22 95.06,31.12 95.52,31.12 96.79,32.39 103.39,32.39 U70.10
$1N22492: length 101.9
  Top Layer w0.254: v1(19.97,54.11) 23.02,54.11 23.78,54.88 60.87,54.88 64.93,50.81 70.52,50.81 71.03,51.32 71.03,52.08 72.04,53.1 v1(73.06,53.1)
  Bottom Layer w0.254: v1(73.06,53.1) 73.97,54.01 U71.7 U71.6 ; v1(19.97,54.11) 19.47,53.61 6.48,53.61 H1.30
$1N22498: length 12.6
  Top Layer w0.254: U70.5 99.07,32.91 95.67,32.91 U72.1
$1N22503: length 106.8
  Top Layer w0.254: v1(37.1,48.66) 36.08,49.68 24.4,49.68 23.89,49.17 12.46,49.17 8.14,53.49 7.12,53.49 6.36,52.73 6.36,50.95 H1.26 ; v1(39.13,46.63) 64.27,46.63 66.81,44.09 70.88,44.09 75.2,39.77 v1(82.31,39.77)
  Bottom Layer w0.254: v1(39.13,46.63) v1(37.1,48.66) ; v1(82.31,39.77) 83.32,38.76 89.67,38.76 90.18,39.26 99.83,39.26 U70.7 U70.6
$1N22509: length 109.6
  Top Layer w0.254: v1(25.67,30.36) 25.92,30.1 v1(65.8,30.1) ; v1(18.05,35.18) 10.43,42.8 10.43,49.66 H1.27
  Bottom Layer w0.254: v1(25.67,30.36) 20.84,35.18 v1(18.05,35.18) ; U70.9 U70.8 98.06,28.58 67.32,28.58 v1(65.8,30.1)
$1N22515: length 113.9
  Top Layer w0.254: v1(66.96,50.05) 64.93,50.05 60.61,54.37 24.04,54.37 23.02,53.35 9.27,53.35 H1.29
  Bottom Layer w0.254: v1(66.96,50.05) 69.76,50.05 71.03,51.32 71.03,52.08 73.82,54.88 99.22,54.88 99.98,55.64 111.16,55.64 U71.2 U71.1
$1N28467: length 126.9
  Top Layer w0.254: U78.12 92.07,17.91 92.07,28.1 91.82,28.35 91.31,28.35 88.26,31.4 88.26,33.43 91.82,36.99 91.82,39.02 v1(92.84,40.03) ; 90.04,57.11 90.04,57.59 v1(89.53,58.1) ; 90.04,57.11 90.04,53.3 v1(90.81,52.53) ; 90.04,57.11 U60.12 ; v1(90.3,50.76) 91.82,49.23 91.82,48.16 ; 91.82,48.16 U66.12 ; 91.82,48.16 v1(92.33,48.67) ; U54.12 91.31,78.16 v1(91.31,78.67) ; v1(96.9,48.42) v1(96.9,46.38)
  Bottom Layer w0.254: v1(89.53,58.1) 89.53,62.67 88.01,64.19 88.01,67.24 88.77,68 91.57,68 94.62,71.05 94.62,71.3 90.3,75.62 90.3,77.65 v1(91.31,78.67) 109.6,96.96 109.6,114.57 U79.28 ; v1(92.84,40.03) 92.84,42.32 v1(96.9,46.38) ; v1(92.33,48.67) 96.65,48.67 v1(96.9,48.42) ; v1(90.81,52.53) 90.81,51.26 v1(90.3,50.76)
$1N28524: length 141.2
  Top Layer w0.254: U54.11 93.09,77.91 91.57,79.43 v1(91.06,79.43) ; v1(88.77,58.86) 88.77,57.11 U60.11 88.88,53.45 93.09,49.23 U66.11 93.09,46.64 v1(92.58,46.13) ; v1(88.88,39.88) 88.88,36.58 85.57,33.28 85.57,31.5 88.88,28.2 U72.11 88.88,22.69 89.89,21.67 v1(89.89,20.85) ; U78.11 92.69,18.06 v1(92.69,18.82)
  Bottom Layer w0.254: v1(89.89,20.85) 90.65,20.85 v1(92.69,18.82) ; v1(88.88,39.88) 88.88,42.42 v1(92.58,46.13) ; v1(88.77,58.86) 85.72,61.91 85.72,74.61 86.23,75.11 86.49,75.11 87.76,73.84 89.53,73.84 89.89,74.2 89.89,78.26 v1(91.06,79.43) 91.06,94.16 101.98,105.09 101.98,110.42 106.3,114.74 106.3,121.42 U79.1
$1N28552: length 22.9
  Top Layer w0.254: U54.9 96.9,76.38 96.9,71.05 93.34,67.49 93.34,59.37 92.69,58.71 U60.14
$1N28558: length 10.6
  Top Layer w0.254: U60.9 86.34,52.43 89.28,49.49 U66.14
$1N28575: length 25.3
  Top Layer w0.254: v1(93.85,38.51) 96.39,41.05 96.39,44.1 95.63,44.86 U66.9 ; U72.14 92.69,30.86 92.07,31.47 92.07,33.5 92.33,33.76 93.42,33.76 v1(95.88,36.22)
  Bottom Layer w0.254: v1(93.85,38.51) 93.85,38.26 v1(95.88,36.22)
$1N28629: length 10.6
  Top Layer w0.254: U78.14 89.28,21.26 86.34,24.21 U72.9
$1N44787: length 131.9
  Top Layer w0.254: v1(51.05,40.28) 52.83,42.06 v1(52.83,45.11) ; U52.8 81.28,91.59 71.88,91.59 71.12,90.83 71.12,88.79 v1(52.83,70.51) ; v1(48.77,25.55) 48.26,25.55 44.57,21.86 H1.3
  Bottom Layer w0.254: v1(52.83,70.51) v1(52.83,45.11) ; U52.8 80.01,90.32 ; v1(51.05,40.28) 51.05,32.91 48.77,30.63 v1(48.77,25.55)
$1N44861: length 129.1
  Top Layer w0.254: U52.13 50.04,70.51 40.64,70.51 39.88,71.27 36.58,71.27 35.56,70.25 35.56,69.24 33.02,66.7 10.16,66.7 8.13,68.73 4.7,68.73 1.65,65.68 v1(1.65,25.41)
  Bottom Layer w0.254: v1(1.65,25.41) H1.4 ; U52.13 U52.14
$1N44872: length 136.7
  Top Layer w0.254: v1(75.69,78.36) 68.58,78.36 53.85,63.63 10.92,63.63 v1(10.16,64.39)
  Bottom Layer w0.254: v1(75.69,78.36) 79.25,81.92 U52.7 ; v1(10.16,64.39) 8.38,66.17 4.7,66.17 0.89,62.36 0.89,23.63 H1.2
$1N45077: length 115
  Top Layer w0.254: R72.2 86.36,96.17 U50.6 ; v1(67.94,42.72) 67.18,42.72 66.42,41.95 66.42,41.7 68.71,39.41 68.71,36.11 v1(66.42,33.83)
  Bottom Layer w0.254: v1(66.42,33.83) 65.15,32.56 65.15,27.98 69.98,23.16 70.23,23.16 71.25,22.14 71.25,5.47 H2.2 ; U50.6 85.23,96.32 85.23,83.35 85.6,82.98 85.6,76.12 79.76,70.28 73.91,70.28 71.12,67.48 71.12,58.85 66.4,54.13 66.4,53.11 66.17,52.88 66.17,44.49 v1(67.94,42.72)
